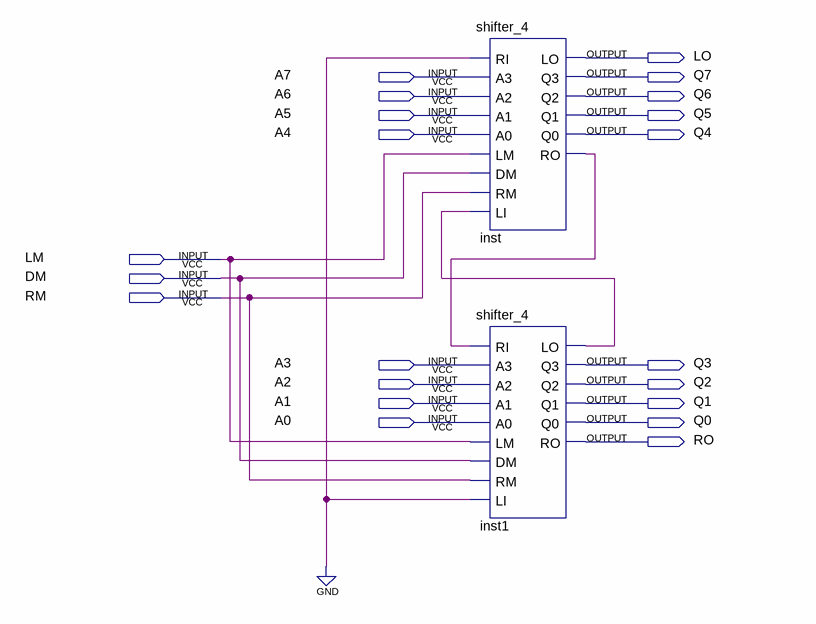
[diagram p0: schematic sheet]
// Quartus schematic shifter_8.bdf as structural Verilog: 2 symbols, 21 pins
module shifter_8 (
  input  A7,
  input  A6,
  input  A5,
  input  A4,
  input  LM,
  input  DM,
  input  RM,
  input  A3,
  input  A2,
  input  A1,
  input  A0,
  output LO,
  output Q7,
  output Q6,
  output Q5,
  output Q4,
  output Q3,
  output Q2,
  output Q1,
  output Q0,
  output RO
);

  wire inst1_lo, inst_ro;

  shifter_4 inst (
    .RI(1'b0), .A3(A7), .A2(A6), .A1(A5), .A0(A4), .LM(LM), .DM(DM), .RM(RM), .LI(inst1_lo), .LO(LO),
    .Q3(Q7), .Q2(Q6), .Q1(Q5), .Q0(Q4), .RO(inst_ro));
  shifter_4 inst1 (
    .RI(inst_ro), .A3(A3), .A2(A2), .A1(A1), .A0(A0), .LM(LM), .DM(DM), .RM(RM), .LI(1'b0), .LO(inst1_lo),
    .Q3(Q3), .Q2(Q2), .Q1(Q1), .Q0(Q0), .RO(RO));
endmodule
